# EAGLE design pcb-covox (EAGLE 7.5.0)
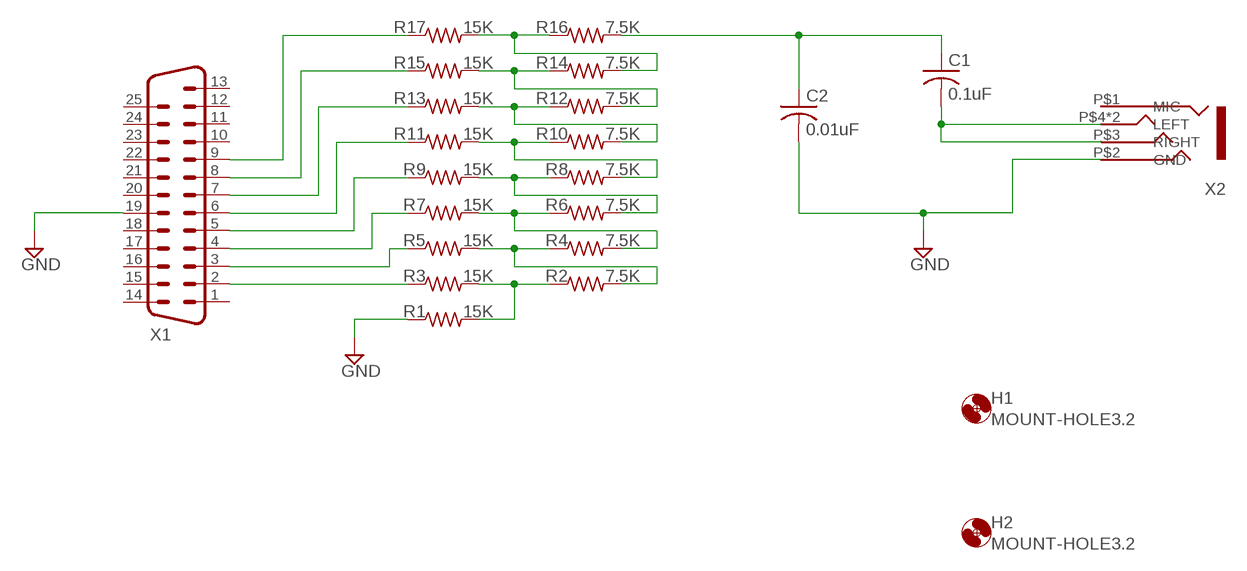
[diagram p0: schematic, sheet 1]

## Parts
C1  0.1uF  C-USC0805  [C0805]
C2  0.01uF  C-USC0805  [C0805]
H1  MOUNT-HOLE3.2  [3,2]
H2  MOUNT-HOLE3.2  [3,2]
R1  15K  R-US_R0805  [R0805]
R2  7.5K  R-US_R0805  [R0805]
R3  15K  R-US_R0805  [R0805]
R4  7.5K  R-US_R0805  [R0805]
R5  15K  R-US_R0805  [R0805]
R6  7.5K  R-US_R0805  [R0805]
R7  15K  R-US_R0805  [R0805]
R8  7.5K  R-US_R0805  [R0805]
R9  15K  R-US_R0805  [R0805]
R10  7.5K  R-US_R0805  [R0805]
R11  15K  R-US_R0805  [R0805]
R12  7.5K  R-US_R0805  [R0805]
R13  15K  R-US_R0805  [R0805]
R14  7.5K  R-US_R0805  [R0805]
R15  15K  R-US_R0805  [R0805]
R16  7.5K  R-US_R0805  [R0805]
R17  15K  R-US_R0805  [R0805]
X1  M25HP  [M25HP]
X2  MJ-2135MJ-2135  [MJ-2135]

## Nets
GND: C2.2 R1.1 X1.19 X2.P$2(GND)
N$1: R3.1 X1.2
N$2: R5.1 X1.3
N$3: R7.1 X1.4
N$4: R9.1 X1.5
N$5: R11.1 X1.6
N$6: R13.1 X1.7
N$7: R15.1 X1.8
N$8: R17.1 X1.9
N$9: R1.2 R2.1 R3.2
N$10: R2.2 R4.1 R5.2
N$11: R4.2 R6.1 R7.2
N$12: R6.2 R8.1 R9.2
N$13: R8.2 R10.1 R11.2
N$14: R10.2 R12.1 R13.2
N$15: R12.2 R14.1 R15.2
N$16: R14.2 R16.1 R17.2
N$17: C1.1 C2.1 R16.2
N$18: C1.2 X2.P$3(RIGHT) X2.P$4(LEFT) X2.P$5(LEFT)
Unconnected: X1.1 X1.10 X1.11 X1.12 X1.13 X1.14 X1.15 X1.16 X1.17 X1.18 X1.20 X1.21 X1.22 X1.23 X1.24 X1.25 X2.P$1(MIC)

## Library data of the parts
C1 C2 = resistor:C-US: CAPACITOR, American symbol
H1 H2 = holes:MOUNT-HOLE: MOUNTING HOLE with drill center marker
R1-R17 = resistor:R-US_: RESISTOR, American symbol
X1 = con-subd:M25: SUB-D; OC_FARNELL: unknown; OC_NEWARK: unknown
X2 = mj-2135:MJ-2135

## Board
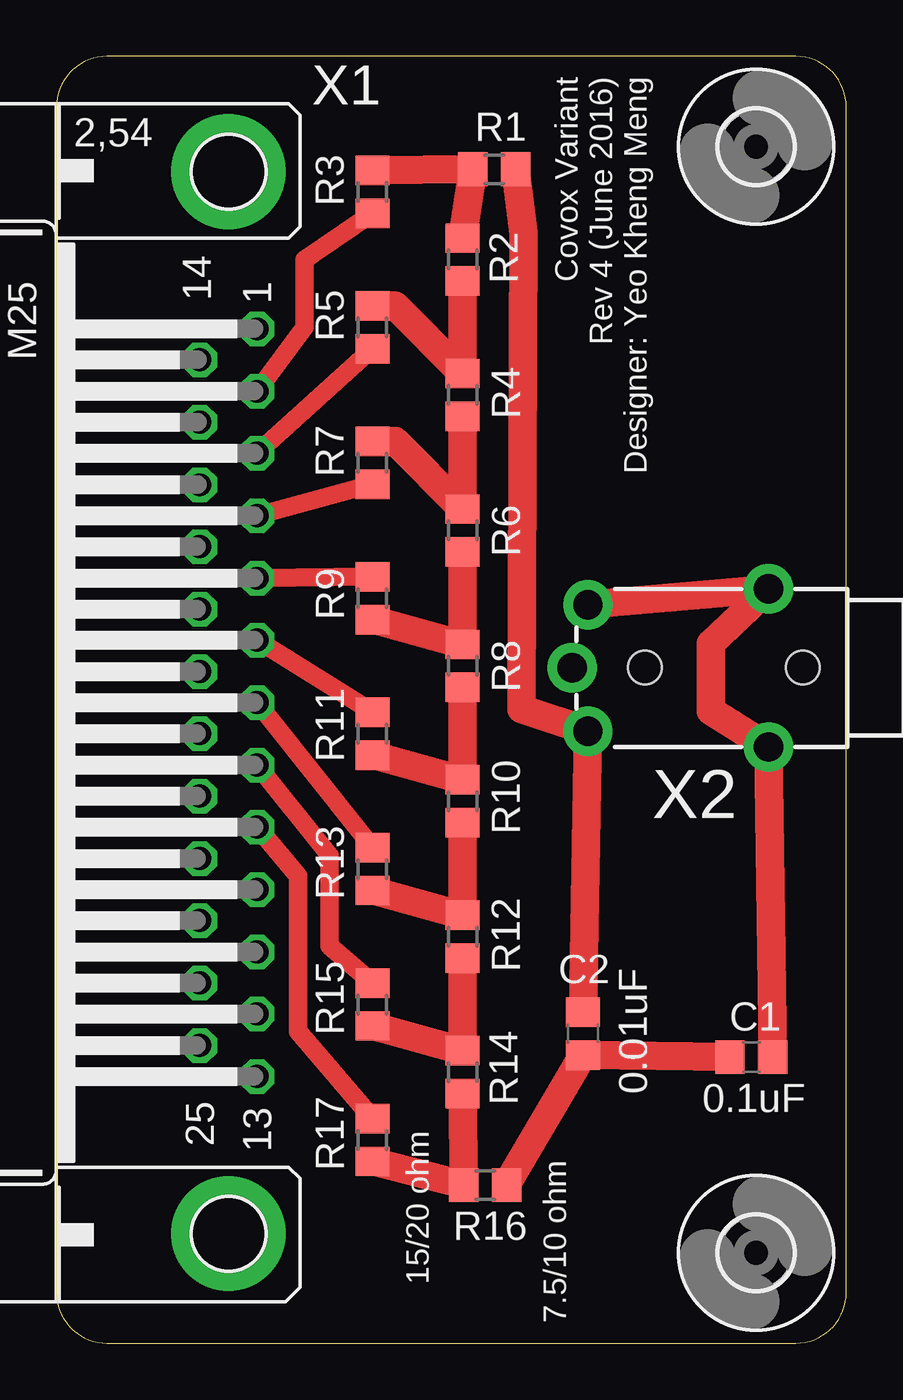
[diagram p1: board, top side]
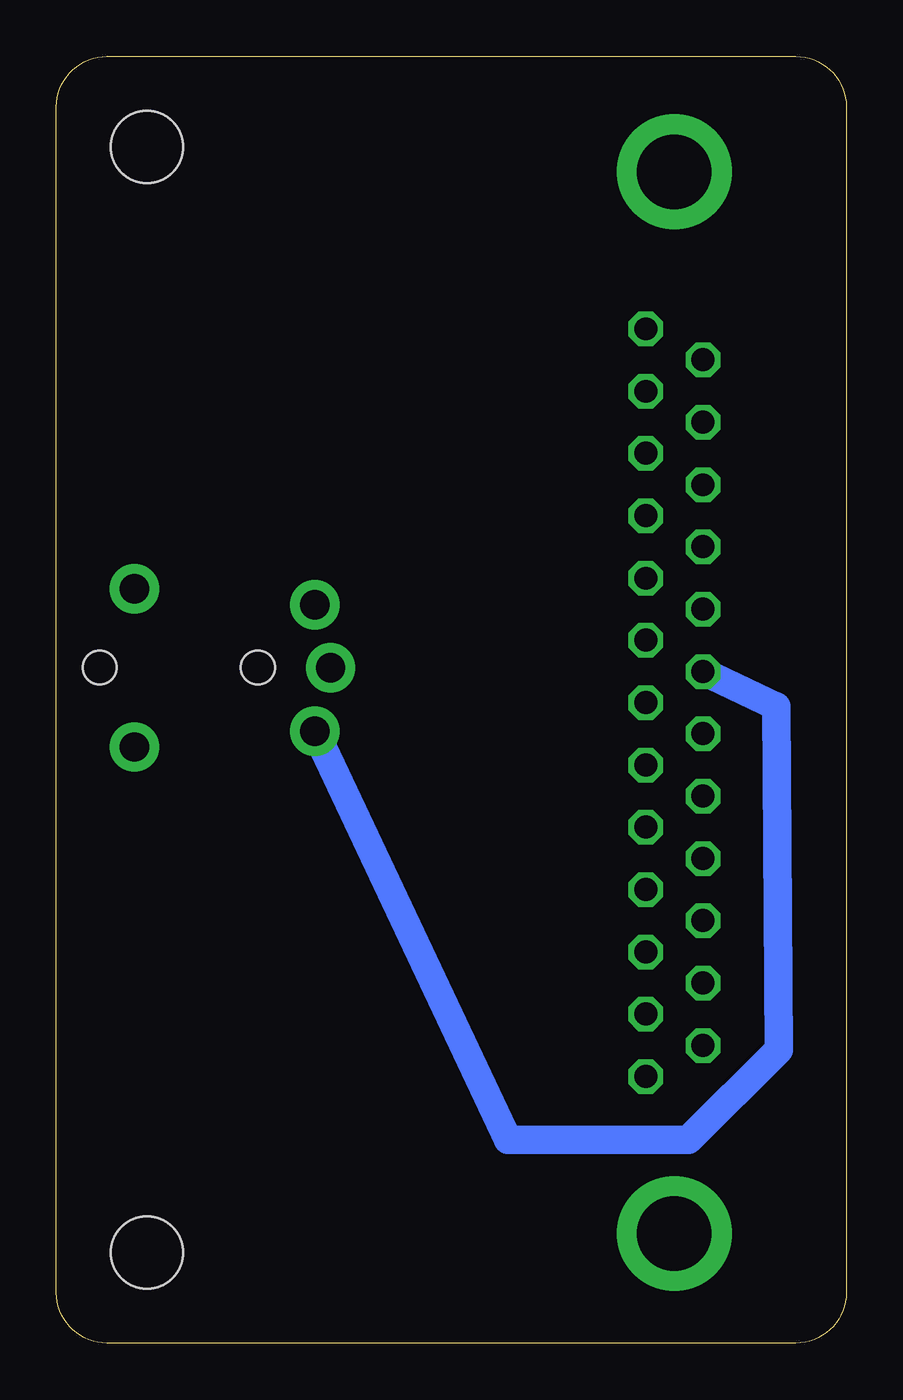
[diagram p2: board, bottom side, seen from below]

Size 35 x 57 mm. Coordinates in mm from the lower left corner, seen from the top.
Outline: 0,54.76 0,2.24 arc90 2.24,0 32.76,0 arc90 35,2.24 35,54.76 arc90 32.76,57 2.24,57 arc90 0,54.76
Copper layers (1*16): Top 0.035mm / dielectric 1.5mm / Bottom 0.035mm
Design rules "Elecrow_2-layer_eagle_rule": minimum track width 6mil, minimum drill 12mil, track to track 6mil, track to pad 6mil, pad to pad 6mil, via to via 6mil, smd to smd 0mil, copper to edge 10mil, drill to drill 10mil, minimum pad ring 10mil, minimum via ring 6mil, stop-mask expansion 2mil, vias tented up to drill 100mil, thermal gap 10mil

### Footprints (pad centres in the part's own frame; a part is rotated, then mirrored left to right if it is on the bottom)
C0805 = smd 1.3 x 1.5: 1 -0.95,0; 2 0.95,0
3,2 = hole 3.2: 0,0
R0805 = smd 1.3 x 1.5: 1 -0.95,0; 2 0.95,0
M25HP = drill 1.016 octagon: 1 -16.561,1.27; 2 -13.792,1.27; 3 -11.049,1.27; 4 -8.28,1.27; 5 -5.512,1.27; 6 -2.769,1.27; 7 0,1.27; 8 2.769,1.27; 9 5.512,1.27; 10 8.28,1.27; 11 11.049,1.27; 12 13.792,1.27; 13 16.561,1.27; 14 -15.189,-1.27; 15 -12.421,-1.27; 16 -9.652,-1.27; 17 -6.909,-1.27; 18 -4.14,-1.27; 19 -1.372,-1.27; 20 1.372,-1.27; 21 4.14,-1.27; 22 6.909,-1.27; 23 9.652,-1.27; 24 12.421,-1.27; 25 15.189,-1.27 | drill 3.302 pad 5.08: G1 -23.52,0; G2 23.52,0
MJ-2135 = drill 1.3 pad 2.184: P$1 0.09,-6.15; P$2 2.89,-5.45; P$3 -2.71,-5.45; P$4 -3.41,2.55; P$5 3.59,2.55 | hole 1.5: 0.065,4.075; 0.065,-2.925

### Placement (x,y rotation side)
C1  30.79,12.67 0 top
C2  23.33,13.71 90 top
H1  31,4 0 top
H2  31,53 0 top
R1  19.4,52 180 top
R2  18,48 270 top
R3  14,51 90 top
R4  18,42 270 top
R5  14,45 90 top
R6  18,36 270 top
R7  14,39 90 top
R8  18,30 270 top
R9  14,33 270 top
R10  18,24 270 top
R11  14,27 270 top
R12  18,18 270 top
R13  14,21 270 top
R14  18,12 270 top
R15  14,15 270 top
R16  19,7 0 top
R17  14,9 270 top
X1  7.62,28.37 270 top
X2  29,30 270 top

### Tracks (layer width: path | path; a pad name or v marks a point on that pad's centre or on a via)
GND
  Top 1.27: R1.1 20.7,49.2 20.6,28.1 X2.P$2 C2.2
  Bottom 1.27: X1.19 3.1,28.2 3,13 7,9 15,9 X2.P$2
N$1
  Top 0.813: X1.2 11,45 11,48 R3.1
N$2
  Top 0.813: X1.3 R5.1
N$3
  Top 0.813: X1.4 R7.1
N$4
  Top 0.813: X1.5 R9.1
N$5
  Top 0.813: X1.6 R11.1
N$6
  Top 0.813: X1.7 R13.1
N$7
  Top 0.813: X1.8 12.1,21.6 12.1,17.6 R15.1
N$8
  Top 0.813: X1.9 10.7,20.7 10.7,13.8 R17.1
N$9
  Top 1.27: R3.2 R1.2 R2.1
N$10
  Top 1.27: R2.2 R4.1 15,45.95 R5.2
N$11
  Top 1.27: R4.2 R6.1 15,39.95 R7.2
N$12
  Top 1.27: R9.2 R8.1 R6.2
N$13
  Top 1.27: R11.2 R10.1 R8.2
N$14
  Top 1.27: R13.2 R12.1 R10.2
N$15
  Top 1.27: R12.2 R14.1 R15.2
N$16
  Top 1.27: R14.2 R16.1 R17.2
N$17
  Top 1.27: R16.2 C2.1 C1.1
N$18
  Top 1.27: C1.2 X2.P$5 29,28 29,31 X2.P$4 X2.P$3

### Text on the board
tPlace: Covox Variant / Rev 4 (June 2016) / Designer: Yeo Kheng Meng | 15/20 ohm | 7.5/10 ohm